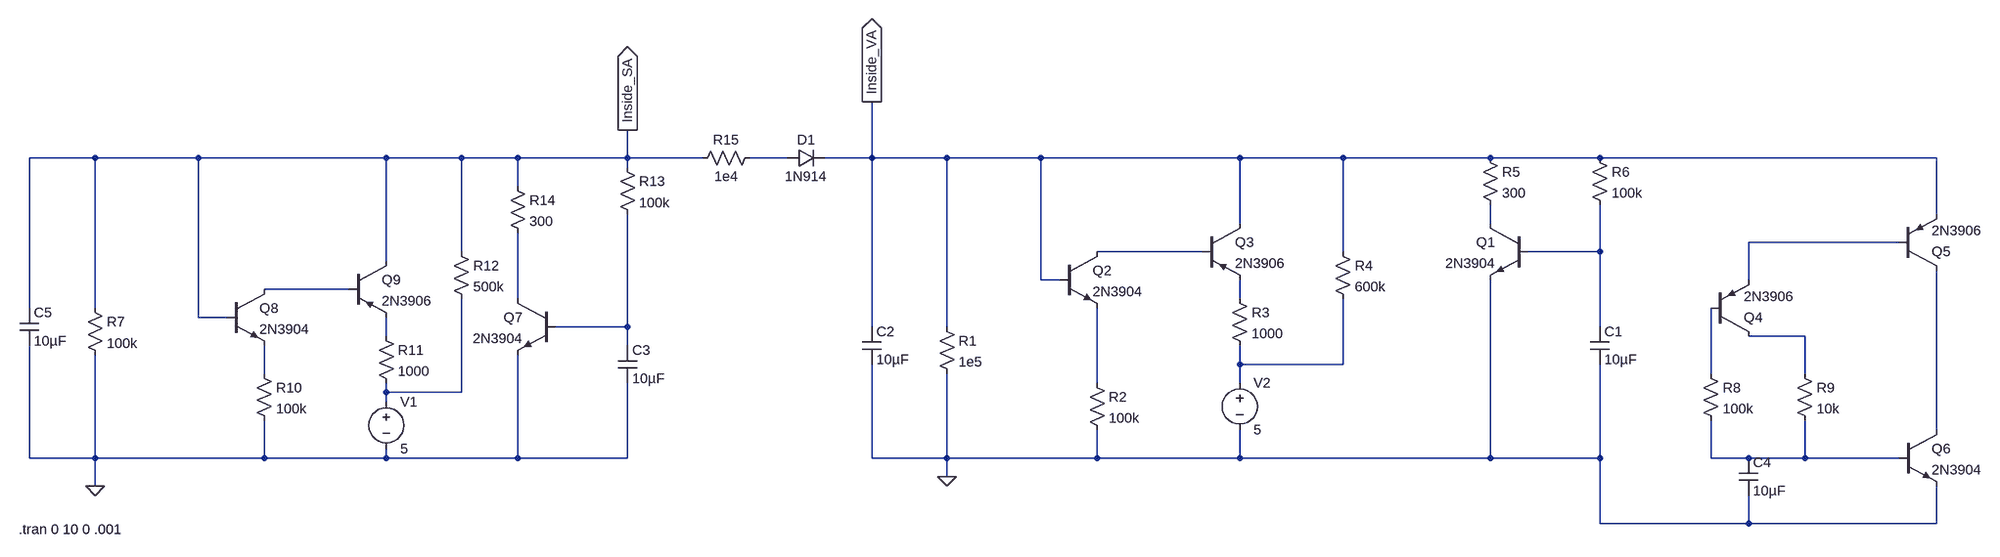
[diagram p0: schematic Pacemaker for Human Heart  SA Ventricular Node.asc]
Pacemaker for Human Heart  SA Ventricular Node.asc, the LTspice schematic file:
Version 4
SHEET 1 3092 680
WIRE -272 -112 -384 -112
WIRE -96 -112 -272 -112
WIRE 224 -112 -96 -112
WIRE 352 -112 224 -112
WIRE 448 -112 352 -112
WIRE 640 -112 640 -160
WIRE 640 -112 448 -112
WIRE 768 -112 640 -112
WIRE 912 -112 848 -112
WIRE 1056 -112 1056 -208
WIRE 1056 -112 976 -112
WIRE 1184 -112 1056 -112
WIRE 1344 -112 1184 -112
WIRE 1696 -112 1344 -112
WIRE 1872 -112 1696 -112
WIRE 2128 -112 1872 -112
WIRE 2336 -112 2128 -112
WIRE 2976 -112 2336 -112
WIRE 640 -96 640 -112
WIRE 448 -64 448 -112
WIRE 2976 -16 2976 -112
WIRE 1696 0 1696 -112
WIRE 2128 0 2128 -32
WIRE 2912 32 2656 32
WIRE 352 48 352 -112
WIRE 1632 48 1440 48
WIRE 1872 48 1872 -112
WIRE 2336 48 2336 -32
WIRE 2336 48 2192 48
WIRE 224 64 224 -112
WIRE 1344 96 1344 -112
WIRE 1376 96 1344 96
WIRE 2656 96 2656 32
WIRE 160 112 16 112
WIRE 448 128 448 16
WIRE 1696 128 1696 96
WIRE -384 144 -384 -112
WIRE -272 144 -272 -112
WIRE -96 160 -96 -112
WIRE -48 160 -96 160
WIRE 640 176 640 -16
WIRE 640 176 512 176
WIRE 1056 176 1056 -112
WIRE 1184 176 1184 -112
WIRE 2336 176 2336 48
WIRE 224 192 224 160
WIRE 2752 192 2656 192
WIRE 640 208 640 176
WIRE 1696 240 1696 208
WIRE 1872 240 1872 128
WIRE 1872 240 1696 240
WIRE 16 256 16 208
WIRE 2592 256 2592 144
WIRE 2752 256 2752 192
WIRE 1440 272 1440 144
WIRE 1696 272 1696 240
WIRE 224 288 224 272
WIRE 352 288 352 128
WIRE 352 288 224 288
WIRE 224 304 224 288
WIRE 2976 352 2976 80
WIRE -384 400 -384 208
WIRE -272 400 -272 224
WIRE -272 400 -384 400
WIRE 16 400 16 336
WIRE 16 400 -272 400
WIRE 224 400 224 384
WIRE 224 400 16 400
WIRE 448 400 448 224
WIRE 448 400 224 400
WIRE 640 400 640 272
WIRE 640 400 448 400
WIRE 1056 400 1056 240
WIRE 1184 400 1184 256
WIRE 1184 400 1056 400
WIRE 1440 400 1440 352
WIRE 1440 400 1184 400
WIRE 1696 400 1696 352
WIRE 1696 400 1440 400
WIRE 2128 400 2128 96
WIRE 2128 400 1696 400
WIRE 2336 400 2336 240
WIRE 2336 400 2128 400
WIRE 2592 400 2592 336
WIRE 2656 400 2592 400
WIRE 2752 400 2752 336
WIRE 2752 400 2656 400
WIRE 2912 400 2752 400
WIRE 1184 432 1184 400
WIRE -272 448 -272 400
WIRE 2336 512 2336 400
WIRE 2656 512 2656 464
WIRE 2656 512 2336 512
WIRE 2976 512 2976 448
WIRE 2976 512 2656 512
FLAG -272 448 0
FLAG 640 -160 Inside_SA
IOPIN 640 -160 Out
FLAG 1184 432 0
FLAG 1056 -208 Inside_VA
IOPIN 1056 -208 Out
SYMBOL npn -48 112 R0
SYMATTR InstName Q8
SYMATTR Value 2N3904
SYMBOL npn 512 128 M0
SYMATTR InstName Q7
SYMATTR Value 2N3904
SYMBOL pnp 160 64 R0
SYMATTR InstName Q9
SYMATTR Value 2N3906
SYMBOL res 336 32 R0
SYMATTR InstName R12
SYMATTR Value 500k
SYMBOL res 0 240 R0
SYMATTR InstName R10
SYMATTR Value 100k
SYMBOL res 208 176 R0
SYMATTR InstName R11
SYMATTR Value 1000
SYMBOL voltage 224 288 R0
WINDOW 123 0 0 Left 0
WINDOW 39 0 0 Left 0
SYMATTR InstName V1
SYMATTR Value 5
SYMBOL res 624 -112 R0
SYMATTR InstName R13
SYMATTR Value 100k
SYMBOL cap 624 208 R0
SYMATTR InstName C3
SYMATTR Value 10µF
SYMBOL res 432 -80 R0
SYMATTR InstName R14
SYMATTR Value 300
SYMBOL cap -400 144 R0
SYMATTR InstName C5
SYMATTR Value 10µF
SYMBOL res -288 128 R0
SYMATTR InstName R7
SYMATTR Value 100k
SYMBOL res 864 -128 R90
WINDOW 0 0 56 VBottom 2
WINDOW 3 32 56 VTop 2
SYMATTR InstName R15
SYMATTR Value 1e4
SYMBOL diode 912 -96 R270
WINDOW 0 32 32 VTop 2
WINDOW 3 0 32 VBottom 2
SYMATTR InstName D1
SYMATTR Value 1N914
SYMBOL cap 1040 176 R0
SYMATTR InstName C2
SYMATTR Value 10µF
SYMBOL res 1168 160 R0
SYMATTR InstName R1
SYMATTR Value 1e5
SYMBOL npn 1376 48 R0
SYMATTR InstName Q2
SYMATTR Value 2N3904
SYMBOL pnp 1632 0 R0
SYMATTR InstName Q3
SYMATTR Value 2N3906
SYMBOL res 1424 256 R0
SYMATTR InstName R2
SYMATTR Value 100k
SYMBOL res 1680 112 R0
SYMATTR InstName R3
SYMATTR Value 1000
SYMBOL voltage 1696 256 R0
WINDOW 123 0 0 Left 0
WINDOW 39 0 0 Left 0
SYMATTR InstName V2
SYMATTR Value 5
SYMBOL res 1856 32 R0
SYMATTR InstName R4
SYMATTR Value 600k
SYMBOL npn 2192 0 M0
SYMATTR InstName Q1
SYMATTR Value 2N3904
SYMBOL res 2112 -128 R0
SYMATTR InstName R5
SYMATTR Value 300
SYMBOL res 2320 -128 R0
SYMATTR InstName R6
SYMATTR Value 100k
SYMBOL cap 2320 176 R0
SYMATTR InstName C1
SYMATTR Value 10µF
SYMBOL pnp 2592 192 M180
SYMATTR InstName Q4
SYMATTR Value 2N3906
SYMBOL pnp 2912 80 M180
SYMATTR InstName Q5
SYMATTR Value 2N3906
SYMBOL res 2576 240 R0
SYMATTR InstName R8
SYMATTR Value 100k
SYMBOL res 2736 240 R0
SYMATTR InstName R9
SYMATTR Value 10k
SYMBOL cap 2640 400 R0
SYMATTR InstName C4
SYMATTR Value 10µF
SYMBOL npn 2912 352 R0
SYMATTR InstName Q6
SYMATTR Value 2N3904
TEXT -402 522 Left 2 !.tran 0 10 0 .001

The netlist it stands for:
* Pacemaker for Human Heart  SA Ventricular Node.asc
Q8 N006 Inside_SA N013 0 2N3904
Q7 N007 N009 0 0 2N3904
Q9 Inside_SA N006 N010 0 2N3906
R12 Inside_SA N016 500k
R10 N013 0 100k
R11 N010 N016 1000
V1 N016 0 5
R13 Inside_SA N009 100k
C3 N009 0 10µF
R14 Inside_SA N007 300
C5 Inside_SA 0 10µF
R7 Inside_SA 0 100k
R15 N001 Inside_SA 1e4
D1 N001 Inside_VA 1N914
C2 Inside_VA 0 10µF
R1 Inside_VA 0 1e5
Q2 N004 Inside_VA N015 0 2N3904
Q3 Inside_VA N004 N008 0 2N3906
R2 N015 0 100k
R3 N008 N012 1000
V2 N012 0 5
R4 Inside_VA N012 600k
Q1 N002 N005 0 0 2N3904
R5 Inside_VA N002 300
R6 Inside_VA N005 100k
C1 N005 0 10µF
Q4 N011 N014 N003 0 2N3906
Q5 N017 N003 Inside_VA 0 2N3906
R8 N014 N018 100k
R9 N011 N018 10k
C4 N018 0 10µF
Q6 N017 N018 0 0 2N3904
.model D D
.lib standard.dio
.model NPN NPN
.model PNP PNP
.lib standard.bjt
.tran 0 10 0 .001
.backanno
.end